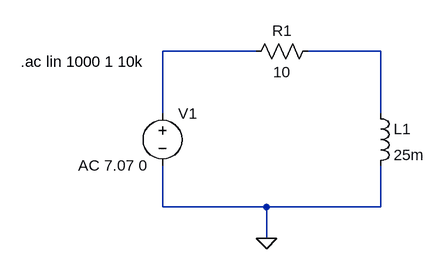
[diagram p0: schematic Phase_measurement (augsto frekvencu filtrs).asc]
Phase_measurement (augsto frekvencu filtrs).asc, the LTspice schematic file:
Version 4
SHEET 1 880 680
WIRE 224 0 80 0
WIRE 416 0 304 0
WIRE 80 96 80 0
WIRE 416 96 416 0
WIRE 80 240 80 176
WIRE 240 240 80 240
WIRE 416 240 416 176
WIRE 416 240 240 240
WIRE 240 288 240 240
FLAG 240 288 0
SYMBOL voltage 80 80 R0
WINDOW 123 -130 96 Left 2
WINDOW 39 0 0 Left 0
SYMATTR InstName V1
SYMATTR Value ""
SYMATTR Value2 AC 7.07 0
SYMBOL res 320 -16 R90
WINDOW 0 0 56 VBottom 2
WINDOW 3 32 56 VTop 2
SYMATTR InstName R1
SYMATTR Value 10
SYMBOL ind 400 80 R0
SYMATTR InstName L1
SYMATTR Value 25m
TEXT -138 16 Left 2 !.ac lin 1000 1 10k

The netlist it stands for:
* Phase_measurement (augsto frekvencu filtrs).asc
V1 N001 0 AC 7.07 0
R1 N002 N001 10
L1 N002 0 25m
.ac lin 1000 1 10k
.backanno
.end